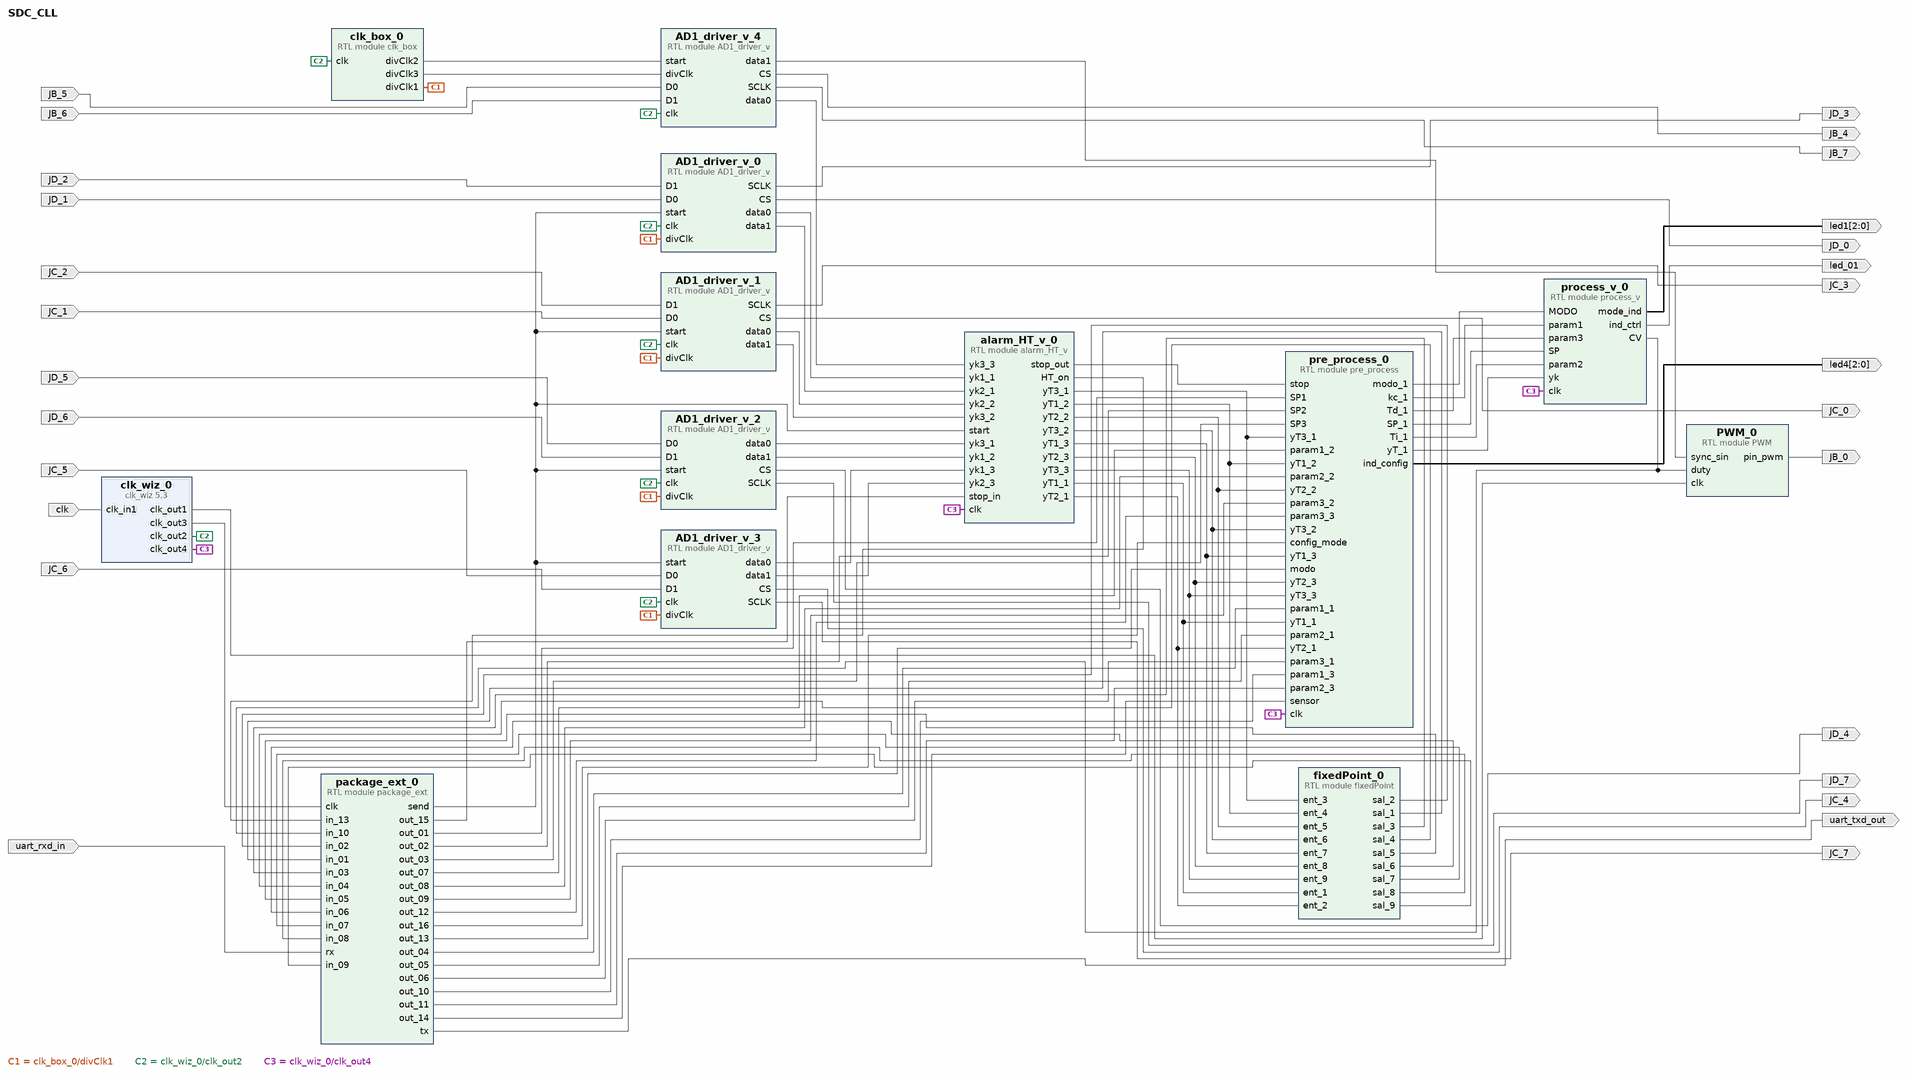
[diagram p0: block diagram of the top level]
# Vivado block design SDC_CLL, Vivado 2016.1
create_bd_design SDC_CLL

create_bd_port -dir O -from 2 -to 0 led1
create_bd_port -dir O led_01
create_bd_port -dir O JB_0
create_bd_port -dir I -type clk clk
create_bd_port -dir O JD_3
create_bd_port -dir O JD_0
create_bd_port -dir I JD_2
create_bd_port -dir I JD_1
create_bd_port -dir O JC_3
create_bd_port -dir O JC_0
create_bd_port -dir I JC_2
create_bd_port -dir I JC_1
create_bd_port -dir I uart_rxd_in
create_bd_port -dir O uart_txd_out
create_bd_port -dir I JD_5
create_bd_port -dir I JD_6
create_bd_port -dir O JD_4
create_bd_port -dir O JD_7
create_bd_port -dir O -from 2 -to 0 led4
create_bd_port -dir I JB_5
create_bd_port -dir I JB_6
create_bd_port -dir O JB_4
create_bd_port -dir O JB_7
create_bd_port -dir I JC_5
create_bd_port -dir I JC_6
create_bd_port -dir O JC_4
create_bd_port -dir O JC_7

create_bd_cell -type ip -vlnv xilinx.com:ip:clk_wiz:5.3 clk_wiz_0
set_property -dict [list \
  CONFIG.PRIMITIVE MMCM \
  CONFIG.CLKOUT1_USED true \
  CONFIG.CLKOUT2_USED true \
  CONFIG.CLKOUT3_USED true \
  CONFIG.CLKOUT4_USED true \
  CONFIG.CLKOUT5_USED false \
  CONFIG.CLKOUT6_USED false \
  CONFIG.CLKOUT7_USED false \
  CONFIG.NUM_OUT_CLKS 4 \
  CONFIG.CLKOUT1_REQUESTED_OUT_FREQ 60 \
  CONFIG.CLKOUT1_REQUESTED_PHASE 0 \
  CONFIG.CLKOUT2_REQUESTED_OUT_FREQ 60 \
  CONFIG.CLKOUT3_REQUESTED_OUT_FREQ 60 \
  CONFIG.CLKOUT4_REQUESTED_OUT_FREQ 10 \
  CONFIG.CLKOUT5_REQUESTED_OUT_FREQ 10 \
  CONFIG.CLKOUT6_REQUESTED_OUT_FREQ 300 \
  CONFIG.CLKOUT7_REQUESTED_OUT_FREQ 6.4512 \
  CONFIG.CLKOUT1_DRIVES BUFG \
  CONFIG.CLKOUT2_DRIVES BUFG \
  CONFIG.CLKOUT3_DRIVES BUFG \
  CONFIG.CLKOUT4_DRIVES BUFG \
  CONFIG.CLKOUT5_DRIVES BUFG \
  CONFIG.CLKOUT6_DRIVES BUFG \
  CONFIG.CLKOUT7_DRIVES BUFG \
  CONFIG.FEEDBACK_SOURCE FDBK_AUTO \
  CONFIG.USE_LOCKED false \
  CONFIG.USE_RESET false \
  CONFIG.MMCM_DIVCLK_DIVIDE 5 \
  CONFIG.MMCM_CLKFBOUT_MULT_F 51.000 \
  CONFIG.MMCM_COMPENSATION ZHOLD \
  CONFIG.MMCM_CLKOUT0_DIVIDE_F 17.000 \
  CONFIG.MMCM_CLKOUT0_PHASE 0.000 \
  CONFIG.MMCM_CLKOUT1_DIVIDE 17 \
  CONFIG.MMCM_CLKOUT2_DIVIDE 17 \
  CONFIG.MMCM_CLKOUT3_DIVIDE 102 \
  CONFIG.MMCM_CLKOUT4_DIVIDE 1 \
  CONFIG.MMCM_CLKOUT5_DIVIDE 1 \
  CONFIG.MMCM_CLKOUT6_DIVIDE 1 \
  CONFIG.CLKOUT1_JITTER 254.384 \
  CONFIG.CLKOUT1_PHASE_ERROR 300.046 \
  CONFIG.CLKOUT2_JITTER 254.384 \
  CONFIG.CLKOUT2_PHASE_ERROR 300.046 \
  CONFIG.CLKOUT3_JITTER 254.384 \
  CONFIG.CLKOUT3_PHASE_ERROR 300.046 \
  CONFIG.CLKOUT4_JITTER 345.967 \
  CONFIG.CLKOUT4_PHASE_ERROR 300.046 \
  CONFIG.CLKOUT5_JITTER 345.967 \
  CONFIG.CLKOUT5_PHASE_ERROR 300.046 \
  CONFIG.CLKOUT6_JITTER 137.681 \
  CONFIG.CLKOUT6_PHASE_ERROR 105.461 \
  CONFIG.CLKOUT7_JITTER 137.681 \
  CONFIG.CLKOUT7_PHASE_ERROR 105.461 \
] [get_bd_cells clk_wiz_0]
create_bd_cell -type module -reference AD1_driver_v AD1_driver_v_0
create_bd_cell -type module -reference AD1_driver_v AD1_driver_v_2
create_bd_cell -type module -reference fixedPoint fixedPoint_0
create_bd_cell -type module -reference AD1_driver_v AD1_driver_v_1
create_bd_cell -type module -reference AD1_driver_v AD1_driver_v_3
create_bd_cell -type module -reference PWM PWM_0
create_bd_cell -type module -reference process_v process_v_0
create_bd_cell -type module -reference clk_box clk_box_0
set_property -dict {CONFIG.RATE1 6 CONFIG.RATE2 204 CONFIG.RATE3 6} [get_bd_cells clk_box_0]
create_bd_cell -type module -reference package_ext package_ext_0
set_property -dict {CONFIG.BAUD 3126 CONFIG.SEND_RATE 133280} [get_bd_cells package_ext_0]
create_bd_cell -type module -reference pre_process pre_process_0
create_bd_cell -type module -reference AD1_driver_v AD1_driver_v_4
create_bd_cell -type module -reference alarm_HT_v alarm_HT_v_0

# ---- connections ----

connect_bd_net [get_bd_pins process_v_0/mode_ind] [get_bd_ports led1]
connect_bd_net -net process_v_0_clk_tm [get_bd_pins process_v_0/ind_ctrl] [get_bd_ports led_01]
connect_bd_net [get_bd_pins PWM_0/pin_pwm] [get_bd_ports JB_0]
connect_bd_net [get_bd_ports clk] [get_bd_pins clk_wiz_0/clk_in1]
connect_bd_net [get_bd_pins AD1_driver_v_0/SCLK] [get_bd_ports JD_3]
connect_bd_net [get_bd_pins AD1_driver_v_0/CS] [get_bd_ports JD_0]
connect_bd_net -net D1_1 [get_bd_ports JD_2] [get_bd_pins AD1_driver_v_0/D1]
connect_bd_net -net D0_1 [get_bd_ports JD_1] [get_bd_pins AD1_driver_v_0/D0]
connect_bd_net [get_bd_pins clk_box_0/divClk1] \
  [get_bd_pins AD1_driver_v_0/divClk] [get_bd_pins AD1_driver_v_2/divClk] [get_bd_pins AD1_driver_v_1/divClk] \
  [get_bd_pins AD1_driver_v_3/divClk]
connect_bd_net [get_bd_pins AD1_driver_v_1/SCLK] [get_bd_ports JC_3]
connect_bd_net [get_bd_pins AD1_driver_v_1/CS] [get_bd_ports JC_0]
connect_bd_net -net D1_2 [get_bd_ports JC_2] [get_bd_pins AD1_driver_v_1/D1]
connect_bd_net -net D0_2 [get_bd_ports JC_1] [get_bd_pins AD1_driver_v_1/D0]
connect_bd_net -net rx_1 [get_bd_ports uart_rxd_in] [get_bd_pins package_ext_0/rx]
connect_bd_net [get_bd_pins package_ext_0/tx] [get_bd_ports uart_txd_out]
connect_bd_net [get_bd_pins clk_wiz_0/clk_out3] [get_bd_pins package_ext_0/clk]
connect_bd_net [get_bd_pins clk_wiz_0/clk_out2] \
  [get_bd_pins AD1_driver_v_0/clk] [get_bd_pins AD1_driver_v_2/clk] [get_bd_pins AD1_driver_v_1/clk] \
  [get_bd_pins AD1_driver_v_3/clk] [get_bd_pins clk_box_0/clk] [get_bd_pins AD1_driver_v_4/clk]
connect_bd_net [get_bd_pins clk_wiz_0/clk_out1] [get_bd_pins PWM_0/clk]
connect_bd_net [get_bd_pins package_ext_0/out_01] [get_bd_pins pre_process_0/SP1]
connect_bd_net [get_bd_pins package_ext_0/out_02] [get_bd_pins pre_process_0/SP2]
connect_bd_net [get_bd_pins package_ext_0/out_03] [get_bd_pins pre_process_0/SP3]
connect_bd_net [get_bd_pins package_ext_0/out_07] [get_bd_pins pre_process_0/param1_2]
connect_bd_net [get_bd_pins package_ext_0/out_08] [get_bd_pins pre_process_0/param2_2]
connect_bd_net [get_bd_pins package_ext_0/out_09] [get_bd_pins pre_process_0/param3_2]
connect_bd_net [get_bd_pins package_ext_0/out_12] [get_bd_pins pre_process_0/param3_3]
connect_bd_net [get_bd_pins package_ext_0/out_16] [get_bd_pins pre_process_0/config_mode]
connect_bd_net [get_bd_pins clk_wiz_0/clk_out4] [get_bd_pins process_v_0/clk] [get_bd_pins pre_process_0/clk] [get_bd_pins alarm_HT_v_0/clk]
connect_bd_net -net D0_3 [get_bd_ports JD_5] [get_bd_pins AD1_driver_v_2/D0]
connect_bd_net -net D1_3 [get_bd_ports JD_6] [get_bd_pins AD1_driver_v_2/D1]
connect_bd_net [get_bd_pins AD1_driver_v_2/CS] [get_bd_ports JD_4]
connect_bd_net [get_bd_pins AD1_driver_v_2/SCLK] [get_bd_ports JD_7]
connect_bd_net [get_bd_pins pre_process_0/modo_1] [get_bd_pins process_v_0/MODO]
connect_bd_net [get_bd_pins package_ext_0/out_13] [get_bd_pins pre_process_0/modo]
connect_bd_net [get_bd_pins pre_process_0/ind_config] [get_bd_ports led4]
connect_bd_net [get_bd_pins pre_process_0/kc_1] [get_bd_pins process_v_0/param1]
connect_bd_net [get_bd_pins pre_process_0/Td_1] [get_bd_pins process_v_0/param3]
connect_bd_net [get_bd_pins pre_process_0/SP_1] [get_bd_pins process_v_0/SP]
connect_bd_net [get_bd_pins pre_process_0/Ti_1] [get_bd_pins process_v_0/param2]
connect_bd_net [get_bd_pins alarm_HT_v_0/yT3_1] [get_bd_pins fixedPoint_0/ent_3] [get_bd_pins pre_process_0/yT3_1]
connect_bd_net [get_bd_pins alarm_HT_v_0/yT1_2] [get_bd_pins fixedPoint_0/ent_4] [get_bd_pins pre_process_0/yT1_2]
connect_bd_net [get_bd_pins alarm_HT_v_0/yT2_2] [get_bd_pins fixedPoint_0/ent_5] [get_bd_pins pre_process_0/yT2_2]
connect_bd_net [get_bd_pins alarm_HT_v_0/yT3_2] [get_bd_pins fixedPoint_0/ent_6] [get_bd_pins pre_process_0/yT3_2]
connect_bd_net [get_bd_pins alarm_HT_v_0/yT1_3] [get_bd_pins fixedPoint_0/ent_7] [get_bd_pins pre_process_0/yT1_3]
connect_bd_net [get_bd_pins alarm_HT_v_0/yT2_3] [get_bd_pins fixedPoint_0/ent_8] [get_bd_pins pre_process_0/yT2_3]
connect_bd_net [get_bd_pins alarm_HT_v_0/yT3_3] [get_bd_pins fixedPoint_0/ent_9] [get_bd_pins pre_process_0/yT3_3]
connect_bd_net [get_bd_pins package_ext_0/out_15] [get_bd_pins alarm_HT_v_0/stop_in]
connect_bd_net [get_bd_pins alarm_HT_v_0/stop_out] [get_bd_pins pre_process_0/stop]
connect_bd_net [get_bd_pins alarm_HT_v_0/HT_on] [get_bd_pins package_ext_0/in_13]
connect_bd_net [get_bd_pins pre_process_0/yT_1] [get_bd_pins process_v_0/yk]
connect_bd_net [get_bd_pins package_ext_0/out_04] [get_bd_pins pre_process_0/param1_1]
connect_bd_net [get_bd_pins package_ext_0/out_05] [get_bd_pins pre_process_0/param2_1]
connect_bd_net [get_bd_pins package_ext_0/out_06] [get_bd_pins pre_process_0/param3_1]
connect_bd_net [get_bd_pins package_ext_0/out_10] [get_bd_pins pre_process_0/param1_3]
connect_bd_net [get_bd_pins package_ext_0/out_11] [get_bd_pins pre_process_0/param2_3]
connect_bd_net [get_bd_pins package_ext_0/out_14] [get_bd_pins pre_process_0/sensor]
connect_bd_net [get_bd_pins process_v_0/CV] [get_bd_pins PWM_0/duty] [get_bd_pins package_ext_0/in_10]
connect_bd_net [get_bd_pins fixedPoint_0/sal_2] [get_bd_pins package_ext_0/in_02]
connect_bd_net [get_bd_pins alarm_HT_v_0/yT1_1] [get_bd_pins fixedPoint_0/ent_1] [get_bd_pins pre_process_0/yT1_1]
connect_bd_net [get_bd_pins fixedPoint_0/sal_1] [get_bd_pins package_ext_0/in_01]
connect_bd_net [get_bd_pins alarm_HT_v_0/yT2_1] [get_bd_pins fixedPoint_0/ent_2] [get_bd_pins pre_process_0/yT2_1]
connect_bd_net [get_bd_pins package_ext_0/send] \
  [get_bd_pins AD1_driver_v_0/start] [get_bd_pins AD1_driver_v_2/start] [get_bd_pins AD1_driver_v_1/start] \
  [get_bd_pins AD1_driver_v_3/start] [get_bd_pins alarm_HT_v_0/start]
connect_bd_net [get_bd_pins clk_box_0/divClk2] [get_bd_pins AD1_driver_v_4/start]
connect_bd_net [get_bd_pins clk_box_0/divClk3] [get_bd_pins AD1_driver_v_4/divClk]
connect_bd_net [get_bd_pins AD1_driver_v_0/data0] [get_bd_pins alarm_HT_v_0/yk1_1]
connect_bd_net [get_bd_pins AD1_driver_v_0/data1] [get_bd_pins alarm_HT_v_0/yk2_1]
connect_bd_net [get_bd_pins AD1_driver_v_2/data0] [get_bd_pins alarm_HT_v_0/yk3_1]
connect_bd_net [get_bd_pins AD1_driver_v_2/data1] [get_bd_pins alarm_HT_v_0/yk1_2]
connect_bd_net [get_bd_pins AD1_driver_v_1/data0] [get_bd_pins alarm_HT_v_0/yk2_2]
connect_bd_net [get_bd_pins AD1_driver_v_1/data1] [get_bd_pins alarm_HT_v_0/yk3_2]
connect_bd_net [get_bd_pins AD1_driver_v_3/data0] [get_bd_pins alarm_HT_v_0/yk1_3]
connect_bd_net [get_bd_pins AD1_driver_v_3/data1] [get_bd_pins alarm_HT_v_0/yk2_3]
connect_bd_net [get_bd_pins AD1_driver_v_4/data0] [get_bd_pins alarm_HT_v_0/yk3_3]
connect_bd_net [get_bd_pins AD1_driver_v_4/data1] [get_bd_pins PWM_0/sync_sin]
connect_bd_net -net D0_4 [get_bd_ports JB_5] [get_bd_pins AD1_driver_v_4/D0]
connect_bd_net -net D1_4 [get_bd_ports JB_6] [get_bd_pins AD1_driver_v_4/D1]
connect_bd_net [get_bd_pins AD1_driver_v_4/CS] [get_bd_ports JB_4]
connect_bd_net [get_bd_pins AD1_driver_v_4/SCLK] [get_bd_ports JB_7]
connect_bd_net -net D0_1_1 [get_bd_ports JC_5] [get_bd_pins AD1_driver_v_3/D0]
connect_bd_net -net D1_1_1 [get_bd_ports JC_6] [get_bd_pins AD1_driver_v_3/D1]
connect_bd_net [get_bd_pins AD1_driver_v_3/CS] [get_bd_ports JC_4]
connect_bd_net [get_bd_pins AD1_driver_v_3/SCLK] [get_bd_ports JC_7]
connect_bd_net [get_bd_pins fixedPoint_0/sal_3] [get_bd_pins package_ext_0/in_03]
connect_bd_net [get_bd_pins fixedPoint_0/sal_4] [get_bd_pins package_ext_0/in_04]
connect_bd_net [get_bd_pins fixedPoint_0/sal_5] [get_bd_pins package_ext_0/in_05]
connect_bd_net [get_bd_pins fixedPoint_0/sal_6] [get_bd_pins package_ext_0/in_06]
connect_bd_net [get_bd_pins fixedPoint_0/sal_7] [get_bd_pins package_ext_0/in_07]
connect_bd_net [get_bd_pins fixedPoint_0/sal_8] [get_bd_pins package_ext_0/in_08]
connect_bd_net [get_bd_pins fixedPoint_0/sal_9] [get_bd_pins package_ext_0/in_09]

validate_bd_design
save_bd_design
